# Altium schematic sheet DISPLAY.SchDoc
size A4; SheetNumber: 11; SheetTotal: 16
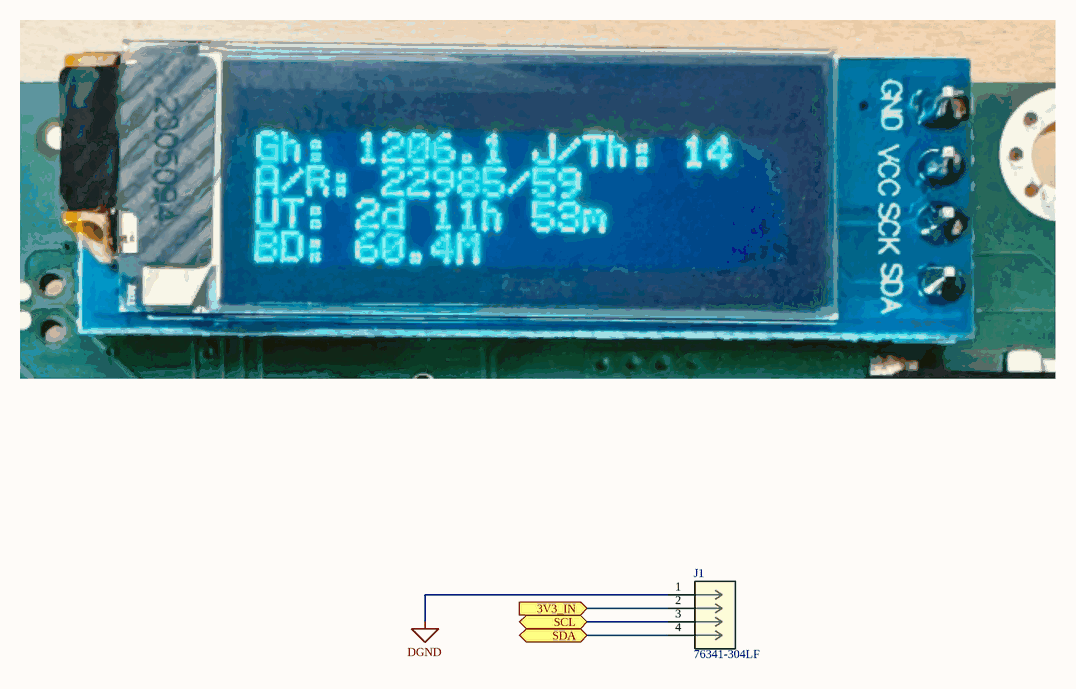
[diagram p0: DISPLAY.SchDoc]

## Parts
J1  76341-304LF  [76341-304LF-Footprint-1]

## Ports
3V3_IN (in), SCL (bidir), SDA (bidir)

## Nets
DGND: J1.1
3V3_IN: J1.2 ; port 3V3_IN
SCL: J1.3 ; port SCL
SDA: J1.4 ; port SDA

## Library data of the parts
J1 = CMP-x00140-1